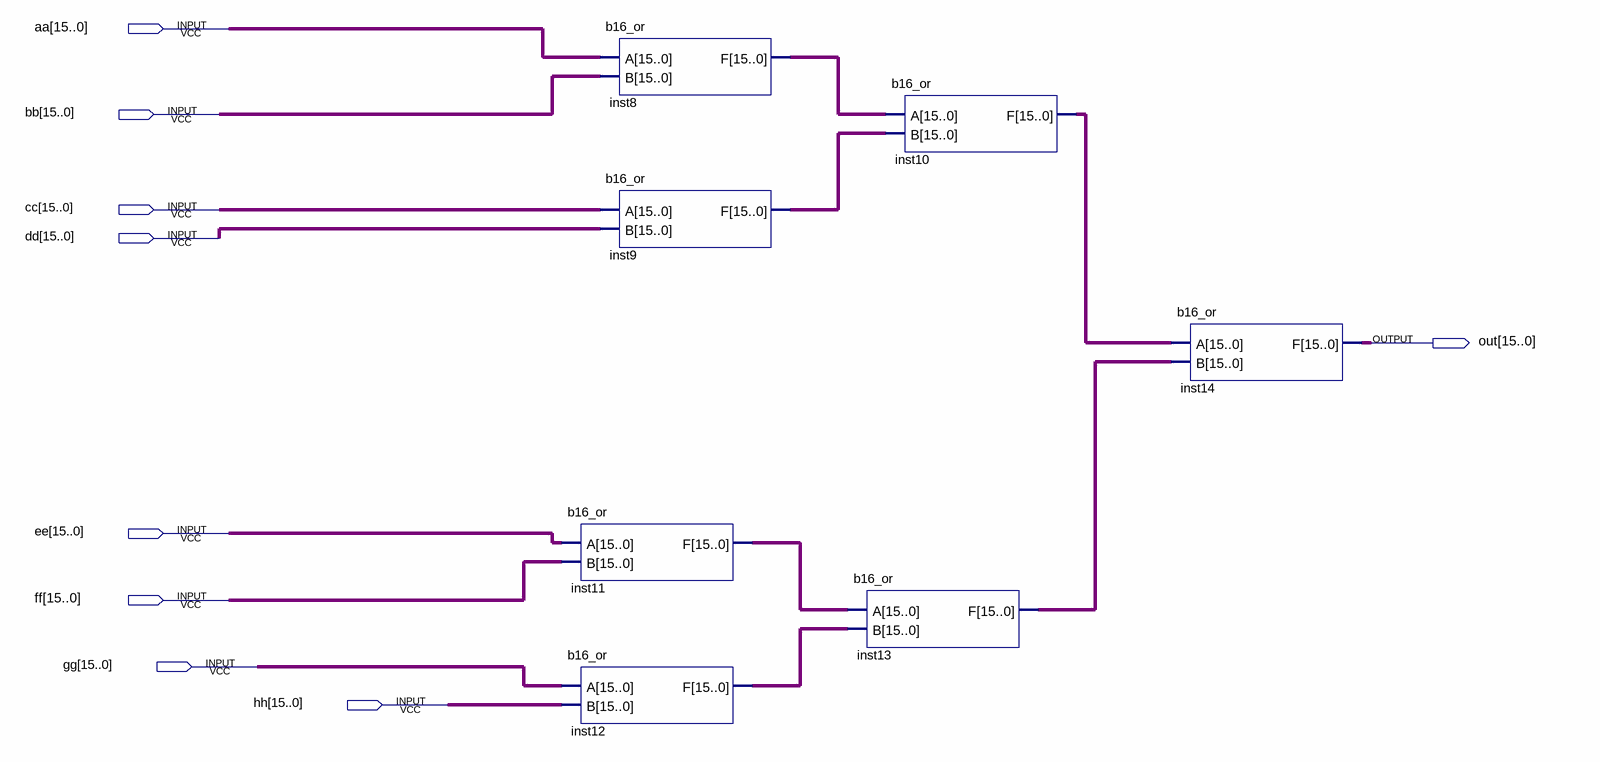
[diagram p0: schematic sheet]
// Quartus schematic b8bus_or_gate.bdf as structural Verilog: 7 symbols, 9 pins
module b8bus_or_gate (
  input  [15:0] aa,
  input  [15:0] bb,
  input  [15:0] cc,
  input  [15:0] dd,
  input  [15:0] ee,
  input  [15:0] ff,
  input  [15:0] gg,
  input  [15:0] hh,
  output [15:0] out
);

  wire [15:0] inst8_f, inst9_f, inst10_f, inst11_f, inst12_f, inst13_f;

  b16_or inst11 (.A(ee), .B(ff), .F(inst11_f));
  b16_or inst12 (.A(gg), .B(hh), .F(inst12_f));
  b16_or inst8 (.A(aa), .B(bb), .F(inst8_f));
  b16_or inst9 (.A(cc), .B(dd), .F(inst9_f));
  b16_or inst10 (.A(inst8_f), .B(inst9_f), .F(inst10_f));
  b16_or inst13 (.A(inst11_f), .B(inst12_f), .F(inst13_f));
  b16_or inst14 (.A(inst10_f), .B(inst13_f), .F(out));
endmodule
